# EasyEDA Pro project I2C measurement.eprj

# Schematic Schematic1
Board Name: Board1; Create Date: 2025-07-18; Page Name: P1; Project Name: I2C measurement; Schematic Name: Schematic1; Update Date: 2025-08-10; Company: NUS Calibur; Drawn: Ng Weiliang; Page Size: A4; Reviewed: Ng Weiliang; Version: V1.0
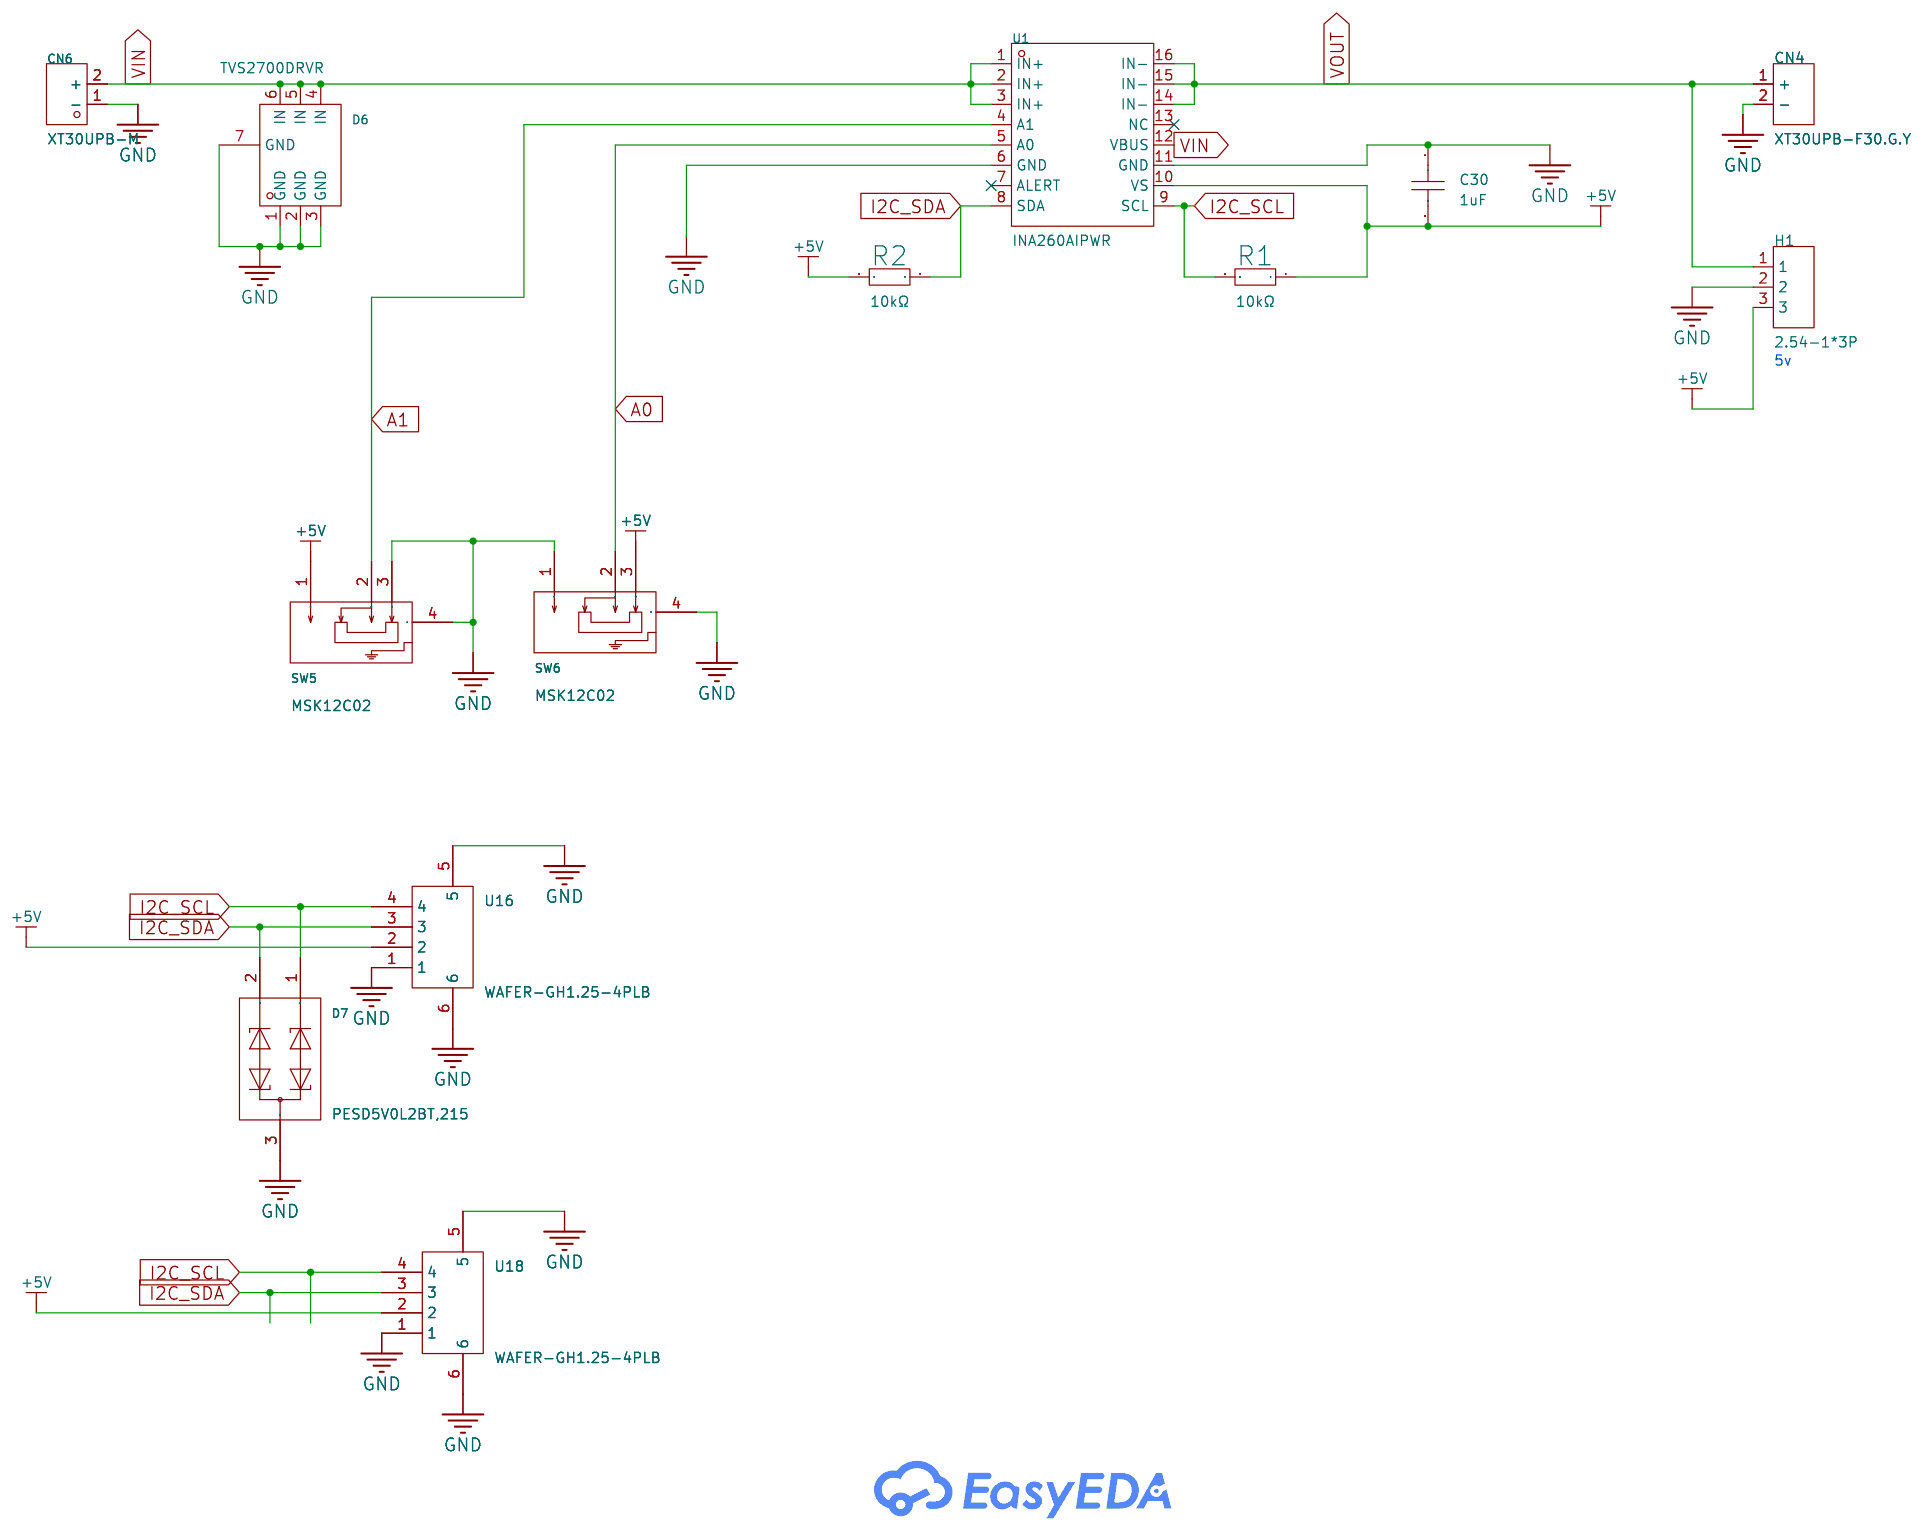
[diagram p0: schematic sheet]

## Parts
C30  1uF  [C0603]
CN4  XT30UPB-F30.G.Y  [CONN-TH_XT30UPB-F]
CN6  XT30UPB-M  [CONN-TH_XT30UPB-M]
D6  TVS2700DRVR  [WSON-6_L2.0-W2.0-P0.65-BL-EP]
D7  PESD5V0L2BT,215  [SOT-23-3_L2.9-W1.3-P1.90-LS2.4-BR]
H1  2.54-1*3P  [HDR-TH_3P-P2.54-V-F]  (no BOM)
R1  10kΩ  [R0603]
R2  10kΩ  [R0603]
SW5  MSK12C02  [SW-TH_MSK12C02]
SW6  MSK12C02  [SW-TH_MSK12C02]
U1  INA260AIPWR  [TSSOP-16_L5.0-W4.4-P0.65-LS6.4-BL-1]
U16  WAFER-GH1.25-4PLB  [CONN-SMD_4P-P1.25_XUNPU_WAFER-GH1.25-4PLB]
U18  WAFER-GH1.25-4PLB  [CONN-SMD_4P-P1.25_XUNPU_WAFER-GH1.25-4PLB]

## Library data of the parts
C30 = CL10A105KB8NNNC: Capacitance: Tolerance:±10% Tolerance:±10% Voltage Rated: Temperature Coefficient:; LCSC Part Name: 1uF ±10% 50V; Supplier Part: C15849; Manufacturer: SAMSUNG(三星); Supplier Footprint: 0603; JLCPCB Part Class: Basic Part; Datasheet: https://atta.szlcsc.com/upload/public/pdf/source/20160218/1457707763339.pdf; Supplier: LCSC; Tolerance: ±10%
CN4 = XT30UPB-F30.G.Y: LCSC Part Name: AMASS(艾迈斯)直立焊板式连接器XT30UPB30-F.G.*; Supplier Part: C108769; Manufacturer: AMASS(艾迈斯); JLCPCB Part Class: Extended Part; Datasheet: https://item.szlcsc.com/datasheet/XT30UPB-F30.G.Y/109989.html; Supplier: LCSC; Type: Aviation model plug; Colour: Yellow; RatedVoltage: DC 500V; InterfaceType: Female; MetalMaterial: Gold plating; InsulationMaterial: PA; RatedCurrent: 15A; contact resistance: 0.65mΩ
CN6 = XT30UPB-M: LCSC Part Name: AMASS(艾迈斯)板载立式 航模锂电池控制器连接器插头 公头XT30UPB-M; Supplier Part: C428721; Manufacturer: AMASS(艾迈斯); JLCPCB Part Class: Extended Part; Datasheet: https://item.szlcsc.com/datasheet/XT30UPB-M/423831.html; Supplier: LCSC; Type: Aviation model plug; Colour: Yellow; RatedVoltage: DC 500V; InterfaceType: Male; MetalMaterial: Gold plating; InsulationMaterial: PA; RatedCurrent: 15A; contact resistance: 0.65mΩ
D6 = TVS2700DRVR: Supplier Part: C523797; Manufacturer: TI(德州仪器); Supplier Footprint: WSON-6-EP(2x2); JLCPCB Part Class: Extended Part; Datasheet: https://www.ti.com/cn/lit/gpn/tvs2700; Supplier: LCSC; Type: ESD
D7 = PESD5V0L2BT,215: Maximum Clamping Voltage:28V Breakdown Voltage:7V Number of Lines:双路 Type:ESD; Supplier Part: C12324; Manufacturer: Nexperia(安世); Supplier Footprint: SOT-23; JLCPCB Part Class: Extended Part; Datasheet: https://atta.szlcsc.com/upload/public/pdf/source/20150713/1457707329955.pdf; Supplier: LCSC; Maximum Clamping Voltage: 28V; Breakdown Voltage: 7V; Number of Lines: 双路; Type: ESD
H1 = 2.54-1*3P母: Pitch:2.54mm Row Spacing:- Mounting Type:Through Hole Number of Rows:1 Number of Positions:3P Insulation Height:- Contact Material:- Contact Plating:Gold; LCSC Part Name: 间距:2.54mm 直插; Supplier Part: C146243; Manufacturer: BOOMELE(博穆精密); Supplier Footprint: 插件,P=2.54mm; JLCPCB Part Class: Extended Part; Supplier: LCSC; Pitch: 2.54mm; Mounting Type: Through Hole; Number of Rows: 1; Number of Positions: 3P; Contact Plating: Gold
R1 R2 = 0603WAF1002T5E: LCSC Part Name: 厚膜电阻 10kΩ ±1% 100mW; Supplier Part: C25804; Manufacturer: UNI-ROYAL(厚声); Supplier Footprint: 0603; JLCPCB Part Class: Basic Part; Datasheet: https://atta.szlcsc.com/upload/public/pdf/source/20200306/C422600_1E6D84923E4A46A82E41ADD87F860B5C.pdf; Supplier: LCSC; Type: Thick Film Resistor; Tolerance: ±1%; Power(Watts): 100mW; Voltage-Supply(Max): 75V; Temperature Coefficient: ±100ppm/℃; Operating Temperature: -55℃~+155℃
SW5 SW6 = MSK12C02: LCSC Part Name: 两档侧拨贴片 7脚 滑动开关; Supplier Part: C431540; Manufacturer: SHOU HAN(首韩); Supplier Footprint: SMD; JLCPCB Part Class: Extended Part; Datasheet: https://atta.szlcsc.com/upload/public/pdf/source/20190925/C431540_89155AEF0758B9AD1B2D805F83FB12E3.pdf; Supplier: LCSC; Circuit: SPDT; Pin Style: SMDSplicing; Switch Length: 8mm; Switch Width: 2.8mm; Switch Height: 1.4mm; Mounting Style: 卧贴; Current Rating (DC): 50mA; Voltage Rating (DC): 12V; Mechanical Life: 1万次; Operating Temperature: -20℃~+70℃
U1 = INA260AIPWR: LCSC Part Name: 具有低漂移、高精度集成分流器的精密电流和功率监测计; Supplier Part: C2155885; Manufacturer: TI(德州仪器); Supplier Footprint: TSSOP-16; JLCPCB Part Class: Extended Part; Datasheet: https://www.ti.com/cn/lit/gpn/ina260; Supplier: LCSC
U16 U18 = WAFER-GH1.25-4PLB: LCSC Part Name: 1x4P 间距:1.25mm 立贴 系列:GH; Supplier Part: C3029370; Manufacturer: XUNPU(讯普); Supplier Footprint: SMD,P=1.25mm; JLCPCB Part Class: Extended Part; Datasheet: https://atta.szlcsc.com/upload/public/pdf/source/20220527/44F824AAC8C2B617205E15955FF9C23D.pdf; Supplier: LCSC; Pins Structure: 1x4P; Pitch: 1.25mm; Mounting Type: Standing paste; Reference Series: GH; Number of Pins: 4P; Number of Rows: 1; Number of PINs Per Row: 4; Current Rating: 1A; Contact Material: Brass; Operating Temperature: -25℃~+85℃; Voltage Rating: 125V; Plastic Material: LCP; Supplementary Features: Auxiliary soldering legs; Color: Beige; Z-Height of the Board: 4.2mm; X-Length of Bottom Edge on Board (Spacing Line): 8.25mm; Y-Width of Bottom Edge on Board: 4.95mm

## Nets
+5V: C30.2 H1.3 R1.1 R2.2 SW5.1 SW6.3 U1.10(VS) U16.2 U18.2
GND: C30.1 CN4.2(-) CN6.1(-) D6.1(GND) D6.2(GND) D6.3(GND) D6.7(GND) D7.3(DC) H1.2 SW5.3 SW5.4 SW6.1 SW6.4 U1.6(GND) U1.11(GND) U16.1 U16.5 U16.6 U18.1 U18.5 U18.6
VIN: CN6.2(+) D6.4(IN) D6.5(IN) D6.6(IN) U1.1(IN+) U1.2(IN+) U1.3(IN+) U1.12(VBUS)
A0: SW6.2 U1.5(A0)
A1: SW5.2 U1.4(A1)
I2C_SCL: D7.1(C1) R1.2 U1.9(SCL) U16.4 U18.4
I2C_SDA: D7.2(C2) R2.1 U1.8(SDA) U16.3 U18.3
VOUT: CN4.1(+) H1.1 U1.14(IN-) U1.15(IN-) U1.16(IN-)

Not connected (* = marked no-connect by the designer): U1 7(ALERT)* 13(NC)*

## Notes on the sheet
- 5v

# Schematic Schematic2
Board Name: Schematic2; Create Date: 2025-08-09; Page Name: P1; Project Name: I2C measurement; Schematic Name: Schematic2; Update Date: 2025-08-10; Company: EasyEDA.com; Page Size: A4; Version: V1.0
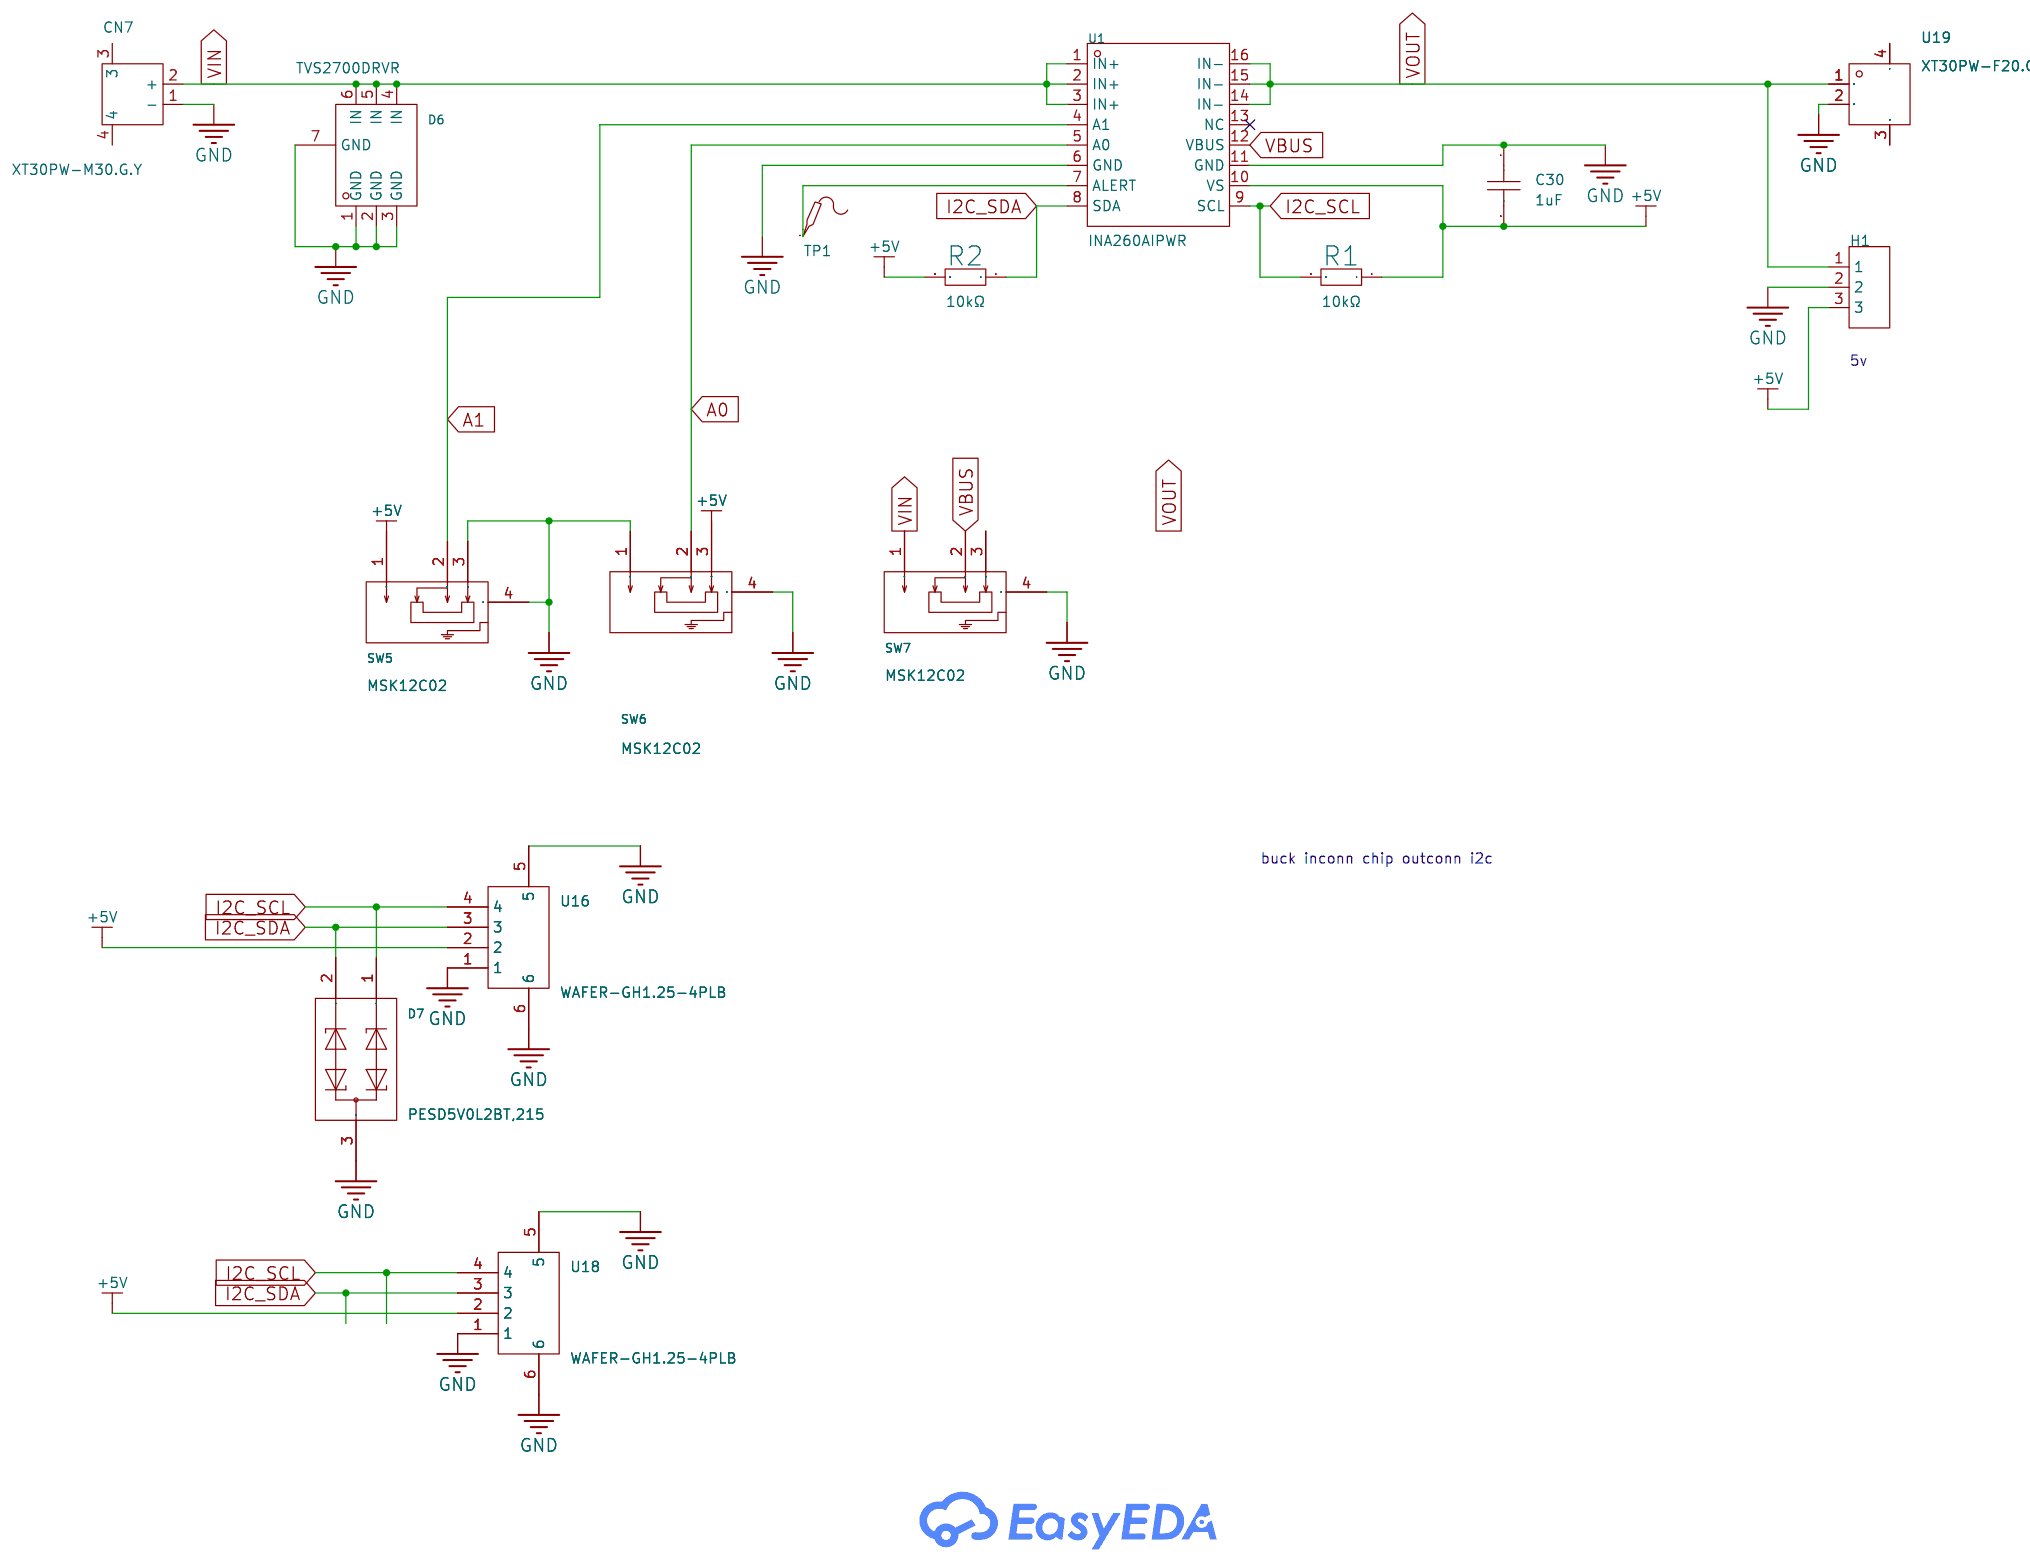
[diagram p1: schematic sheet]

## Parts
C30  1uF  [C0603]
CN7  XT30PW-M30.G.Y  [CONN-TH_XT30PW-M]
D6  TVS2700DRVR  [WSON-6_L2.0-W2.0-P0.65-BL-EP]
D7  PESD5V0L2BT,215  [SOT-23-3_L2.9-W1.3-P1.90-LS2.4-BR]
H1  2.54-1*3P母  [HDR-TH_3P-P2.54-V-F]
R1  10kΩ  [R0603]
R2  10kΩ  [R0603]
SW5  MSK12C02  [SW-TH_MSK12C02]
SW6  MSK12C02  [SW-TH_MSK12C02]
SW7  MSK12C02  [SW-TH_MSK12C02]
TP1  -  [Test-Point-0.5mm]
U1  INA260AIPWR  [TSSOP-16_L5.0-W4.4-P0.65-LS6.4-BL-1]
U16  WAFER-GH1.25-4PLB  [CONN-SMD_4P-P1.25_XUNPU_WAFER-GH1.25-4PLB]
U18  WAFER-GH1.25-4PLB  [CONN-SMD_4P-P1.25_XUNPU_WAFER-GH1.25-4PLB]
U19  XT30PW-F20.G.Y  [CONN-TH_XT30PW-F-1]

## Library data of the parts
C30 = CL10A105KB8NNNC: Capacitance: Tolerance:±10% Tolerance:±10% Voltage Rated: Temperature Coefficient:; LCSC Part Name: 1uF ±10% 50V; Supplier Part: C15849; Manufacturer: SAMSUNG(三星); Supplier Footprint: 0603; JLCPCB Part Class: Basic Part; Datasheet: https://atta.szlcsc.com/upload/public/pdf/source/20160218/1457707763339.pdf; Supplier: LCSC; Tolerance: ±10%
CN7 = XT30PW-M30.G.Y: Power:- Output:- Input:- Size:- Interface:- Type:- Colour:- MaximumCurrent:- Type:Aviation model plug RatedVoltage:DC 500V Type1:- NumberOfUSBHoles:- InterfaceType:Male MetalMaterial:- InsulationMaterial:- RatedCurrent:15A RecommendedWireGauge:16/18/20AWG; LCSC Part Name: AMASS(艾迈斯)航模插头 卧式弯脚 XT30PW-M公头; Supplier Part: C431092; Manufacturer: AMASS(艾迈斯); JLCPCB Part Class: Extended Part; Datasheet: https://atta.szlcsc.com/upload/public/pdf/source/20220222/6A9F22F7850E25B33E1BE430ADF8560B.pdf; Supplier: LCSC; Type: Aviation model plug; RatedVoltage: DC 500V; InterfaceType: Male; RatedCurrent: 15A; RecommendedWireGauge: 16/18/20AWG; contact resistance: 1.2mΩ; specifications: 2pin
D6 = TVS2700DRVR: Supplier Part: C523797; Manufacturer: TI(德州仪器); Supplier Footprint: WSON-6-EP(2x2); JLCPCB Part Class: Extended Part; Datasheet: https://www.ti.com/cn/lit/gpn/tvs2700; Supplier: LCSC; Type: ESD
D7 = PESD5V0L2BT,215: Maximum Clamping Voltage:28V Breakdown Voltage:7V Number of Lines:双路 Type:ESD; Supplier Part: C12324; Manufacturer: Nexperia(安世); Supplier Footprint: SOT-23; JLCPCB Part Class: Extended Part; Datasheet: https://atta.szlcsc.com/upload/public/pdf/source/20150713/1457707329955.pdf; Supplier: LCSC; Maximum Clamping Voltage: 28V; Breakdown Voltage: 7V; Number of Lines: 双路; Type: ESD
H1 = 2.54-1*3P母: Pitch:2.54mm Row Spacing:- Mounting Type:Through Hole Number of Rows:1 Number of Positions:3P Insulation Height:- Contact Material:- Contact Plating:Gold; LCSC Part Name: 间距:2.54mm 直插; Supplier Part: C146243; Manufacturer: BOOMELE(博穆精密); Supplier Footprint: 插件,P=2.54mm; JLCPCB Part Class: Extended Part; Supplier: LCSC; Pitch: 2.54mm; Mounting Type: Through Hole; Number of Rows: 1; Number of Positions: 3P; Contact Plating: Gold
R1 R2 = 0603WAF1002T5E: LCSC Part Name: 厚膜电阻 10kΩ ±1% 100mW; Supplier Part: C25804; Manufacturer: UNI-ROYAL(厚声); Supplier Footprint: 0603; JLCPCB Part Class: Basic Part; Datasheet: https://atta.szlcsc.com/upload/public/pdf/source/20200306/C422600_1E6D84923E4A46A82E41ADD87F860B5C.pdf; Supplier: LCSC; Type: Thick Film Resistor; Tolerance: ±1%; Power(Watts): 100mW; Voltage-Supply(Max): 75V; Temperature Coefficient: ±100ppm/℃; Operating Temperature: -55℃~+155℃
SW5-SW7 = MSK12C02: LCSC Part Name: 两档侧拨贴片 7脚 滑动开关; Supplier Part: C431540; Manufacturer: SHOU HAN(首韩); Supplier Footprint: SMD; JLCPCB Part Class: Extended Part; Datasheet: https://atta.szlcsc.com/upload/public/pdf/source/20190925/C431540_89155AEF0758B9AD1B2D805F83FB12E3.pdf; Supplier: LCSC; Circuit: SPDT; Pin Style: SMDSplicing; Switch Length: 8mm; Switch Width: 2.8mm; Switch Height: 1.4mm; Mounting Style: 卧贴; Current Rating (DC): 50mA; Voltage Rating (DC): 12V; Mechanical Life: 1万次; Operating Temperature: -20℃~+70℃
TP1 = Test-Point
U1 = INA260AIPWR: LCSC Part Name: 具有低漂移、高精度集成分流器的精密电流和功率监测计; Supplier Part: C2155885; Manufacturer: TI(德州仪器); Supplier Footprint: TSSOP-16; JLCPCB Part Class: Extended Part; Datasheet: https://www.ti.com/cn/lit/gpn/ina260; Supplier: LCSC
U16 U18 = WAFER-GH1.25-4PLB: LCSC Part Name: 1x4P 间距:1.25mm 立贴 系列:GH; Supplier Part: C3029370; Manufacturer: XUNPU(讯普); Supplier Footprint: SMD,P=1.25mm; JLCPCB Part Class: Extended Part; Datasheet: https://atta.szlcsc.com/upload/public/pdf/source/20220527/44F824AAC8C2B617205E15955FF9C23D.pdf; Supplier: LCSC; Pins Structure: 1x4P; Pitch: 1.25mm; Mounting Type: Standing paste; Reference Series: GH; Number of Pins: 4P; Number of Rows: 1; Number of PINs Per Row: 4; Current Rating: 1A; Contact Material: Brass; Operating Temperature: -25℃~+85℃; Voltage Rating: 125V; Plastic Material: LCP; Supplementary Features: Auxiliary soldering legs; Color: Beige; Z-Height of the Board: 4.2mm; X-Length of Bottom Edge on Board (Spacing Line): 8.25mm; Y-Width of Bottom Edge on Board: 4.95mm
U19 = XT30PW-F20.G.Y: Power:- Output:- Input:- Size:- Interface:- Type:- Colour:- MaximumCurrent:- Type:航模插头 RatedVoltage:- Type1:- NumberOfUSBHoles:- InterfaceType:母头 MetalMaterial:- InsulationMaterial:- RatedCurrent:- RecommendedWireGauge:- FlameRetardantGrade:- contact resi; LCSC Part Name: AMASS(艾迈斯)电源连接器 母头 XT30PW-F; Supplier Part: C2913282; Manufacturer: AMASS(艾迈斯); JLCPCB Part Class: Extended Part; Datasheet: https://atta.szlcsc.com/upload/public/pdf/source/20231218/06CFCF98887A9A87638B0856A725C8FD.pdf; Supplier: LCSC; Type: 航模插头; InterfaceType: 母头

## Nets
+5V: C30.2 H1.3 R1.1 R2.2 SW5.1 SW6.3 U1.10(VS) U16.2 U18.2
GND: C30.1 CN7.1(-) D6.1(GND) D6.2(GND) D6.3(GND) D6.7(GND) D7.3(DC) H1.2 SW5.3 SW5.4 SW6.1 SW6.4 SW7.4 U1.6(GND) U1.11(GND) U16.1 U16.5 U16.6 U18.1 U18.5 U18.6 U19.2
VBUS: SW7.2 U1.12(VBUS)
VIN: CN7.2(+) D6.4(IN) D6.5(IN) D6.6(IN) SW7.1 U1.1(IN+) U1.2(IN+) U1.3(IN+)
A0: SW6.2 U1.5(A0)
A1: SW5.2 U1.4(A1)
I2C_SCL: D7.1(C1) R1.2 U1.9(SCL) U16.4 U18.4
I2C_SDA: D7.2(C2) R2.1 U1.8(SDA) U16.3 U18.3
VOUT: H1.1 U1.14(IN-) U1.15(IN-) U1.16(IN-) U19.1
$1N1251: TP1.1 U1.7(ALERT)

Not connected (* = marked no-connect by the designer): CN7 3 4; SW7 3; U1 13(NC)*; U19 3 4

## Notes on the sheet
- 5v
- buck inconn chip outconn i2c

# Board PCB1
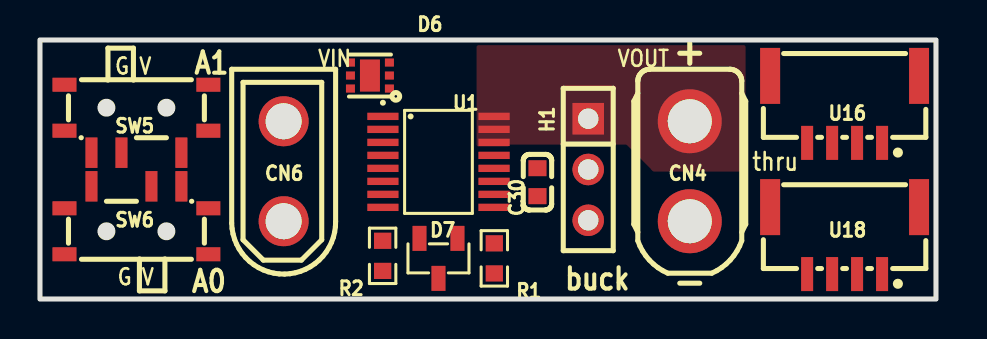
[diagram p2: board, top side]
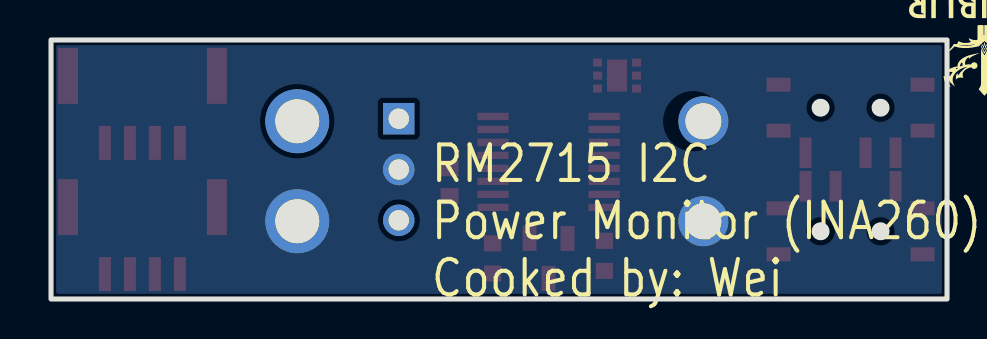
[diagram p3: board, bottom side, seen from below]

Outline 44.83 x 12.95 mm; copper layers: Top Layer, Bottom Layer. Coordinates in mm from the lower left corner of the outline.
Outline path: rectangle 0,12.95 44.83,0
Stack: Top Layer 0.035mm / Dielectric1 1.51mm FR4 er 4.5 / Bottom Layer 0.035mm

## Design rules (mm)
template: Custom Config
spacing copperThickness1oz (default): track to track 0.102, other pairs 0.152 to 0.3
spacing copperThickness2oz: track to track 0.203, other pairs 0.152 to 0.3
track width copperThickness1oz (default): min 0.127, default 0.254, max 2.54
track width copperThickness2oz: min 0.203, default 0.254, max 2.54
differential pair differentialPair (default): width min 0.127, default 0.254, max 2.54; gap min 0.152, default 0.152
via viaSize (default): diameter min 0.5, default 0.61, max 10; hole min 0.3, default 0.305, max 6.3

## Placement (name value [footprint] x y rotation side)
C30  1uF  [C0603]  24.89 5.84 270 top
CN4  XT30UPB-F30.G.Y  [CONN-TH_XT30UPB-F]  32.51 6.39 270 top
CN6  XT30UPB-M  [CONN-TH_XT30UPB-M]  12.19 6.39 90 top
D6  TVS2700DRVR  [WSON-6_L2.0-W2.0-P0.65-BL-EP]  16.51 11.18 90 top
D7  PESD5V0L2BT,215  [SOT-23-3_L2.9-W1.3-P1.90-LS2.4-BR]  19.94 2.03 90 top
H1  2.54-1*3P  [HDR-TH_3P-P2.54-V-F]  27.43 6.48 270 top
R1  10kΩ  [R0603]  22.73 2.03 90 top
R2  10kΩ  [R0603]  17.15 2.16 270 top
SW5  MSK12C02  [SW-TH_MSK12C02]  4.83 9.02 180 top
SW6  MSK12C02  [SW-TH_MSK12C02]  4.83 3.94 0 top
U1  INA260AIPWR  [TSSOP-16_L5.0-W4.4-P0.65-LS6.4-BL-1]  19.94 6.86 270 top
U16  WAFER-GH1.25-4PLB  [CONN-SMD_4P-P1.25_XUNPU_WAFER-GH1.25-4PLB]  40.26 9.48 180 top
U18  WAFER-GH1.25-4PLB  [CONN-SMD_4P-P1.25_XUNPU_WAFER-GH1.25-4PLB]  40.26 2.92 180 top

## Footprints (pads in the part's own frame, mm; a bottom-side part is the same pattern mirrored in y, then rotated)
C0603
  rect 0.8x0.9 smd: 1(-0.7,0) 2(0.7,0)
CONN-SMD_4P-P1.25_XUNPU_WAFER-GH1.25-4PLB
  rect 0.6x1.7 smd: 1(-1.875,1.675) 2(-0.625,1.675) 3(0.625,1.675) 4(1.875,1.675)
  rect 1x2.8 smd: 5(-3.725,-1.675) 6(3.725,-1.675)
CONN-TH_XT30UPB-F
  round 3.2 hole 2.2: 1(-2.5,0) 2(2.5,0)
CONN-TH_XT30UPB-M
  round 2.5 hole 1.8: 1(-2.5,0) 2(2.5,0)
HDR-TH_3P-P2.54-V-F
  rect 1.575x1.575 hole 1.02: 1(-2.54,0)
  round 1.575 hole 1.02: 2(0,0) 3(2.54,0)
R0603
  rect 0.806x0.864 smd: 1(-0.753,0) 2(0.753,0)
SOT-23-3_L2.9-W1.3-P1.90-LS2.4-BR
  rect 1.25x0.7 smd: 1(1,-0.95) 2(1,0.95) 3(-1,0)
SW-TH_MSK12C02
  rect 0.6x1.524 smd: 1(-2.25,1.7) 2(0.75,1.7) 3(2.25,1.7)
  rect 1.2x0.7 smd: 4(-3.6,0.6) 4(-3.6,-1.7) 4(3.6,0.6) 4(3.6,-1.7)
TSSOP-16_L5.0-W4.4-P0.65-LS6.4-BL-1
  rect 0.364x1.56 smd: 1(-2.275,-2.78) 2(-1.625,-2.78) 3(-0.975,-2.78) 4(-0.325,-2.78) 5(0.325,-2.78) 6(0.975,-2.78) 7(1.625,-2.78) 8(2.275,-2.78) 9(2.275,2.78) 10(1.625,2.78) 11(0.975,2.78) 12(0.325,2.78) 13(-0.325,2.78) 14(-0.975,2.78) 15(-1.625,2.78) 16(-2.275,2.78)
WSON-6_L2.0-W2.0-P0.65-BL-EP
  rect 0.4x0.45 smd: 1(-0.65,-0.975) 2(0,-0.975) 3(0.65,-0.975) 4(0.65,0.975) 5(0,0.975) 6(-0.65,0.975)
  rect 1.6x1 smd: 7(0,0)

## Nets
As in the schematic.

Pads without a net: U1 7 13

## Copper pours and planes (outline as drawn; the poured copper is in the pictures)
GND on Bottom Layer: -20.32,13.46 51.56,13.46 51.56,-0.76 -20.32,-0.76
VOUT on Top Layer: 35.31,12.93 21.84,12.93 21.84,7.6 23.5,7.6 23.5,7.72 29.34,7.72 30.69,6.37 35.31,6.37

## Text on the board
Bottom Silkscreen Layer: RM2715 I2C / Power Monitor (INA260) / Cooked by: Wei
Top Silkscreen Layer: G V | VIN | VOUT | thru | MAX: / 27V / 15A | A0 | A1 | buck

# Board PCB2
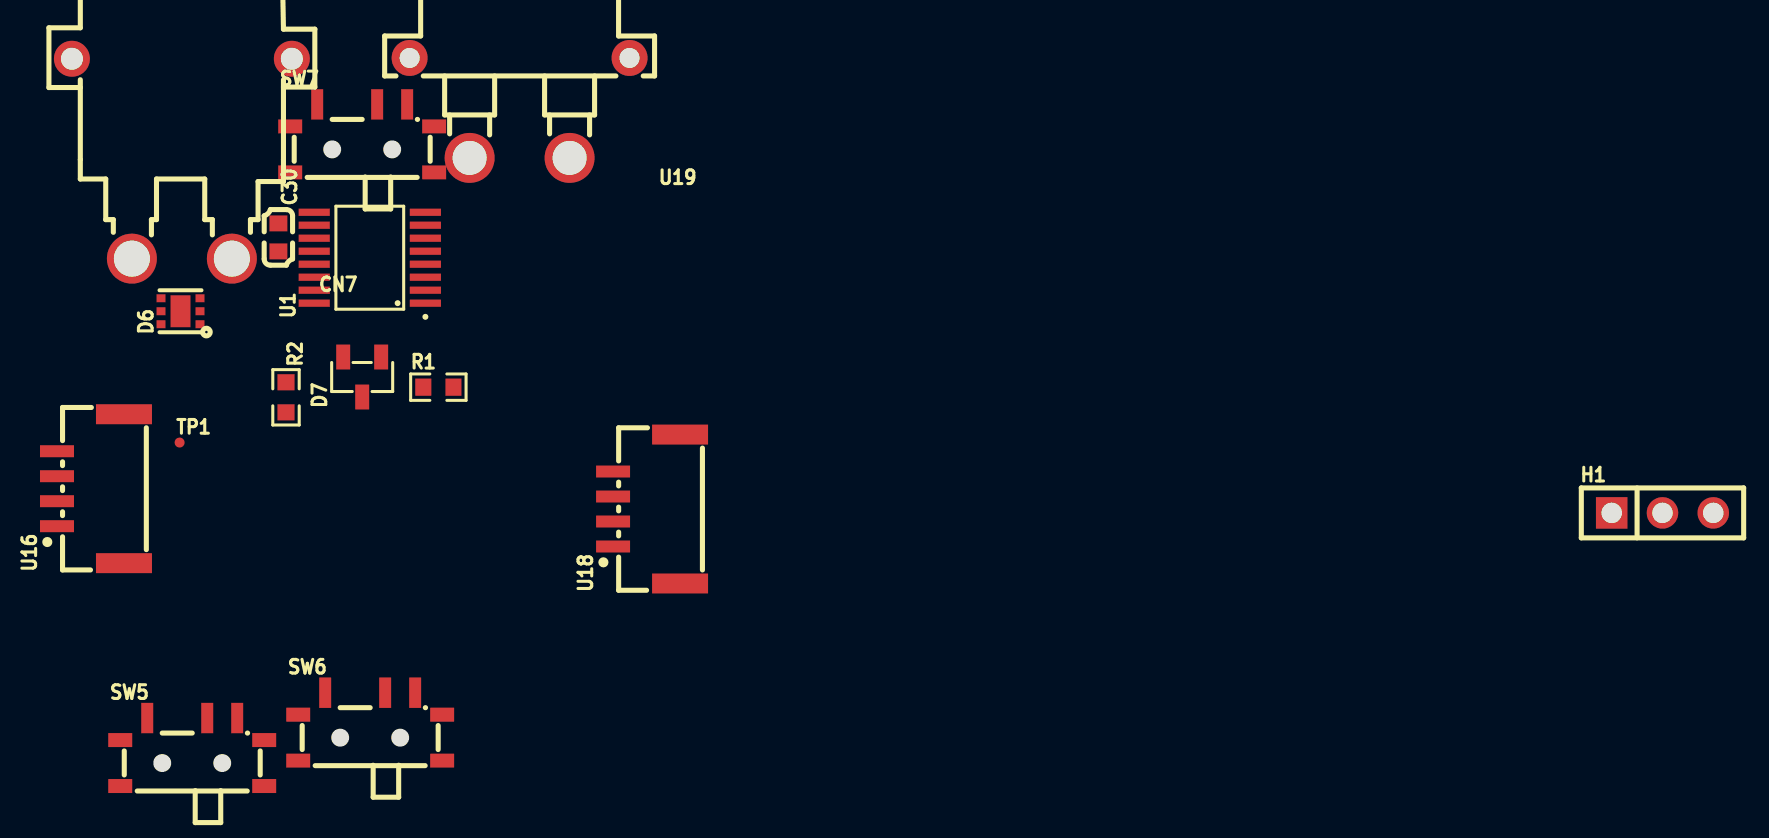
[diagram p4: board, top side]
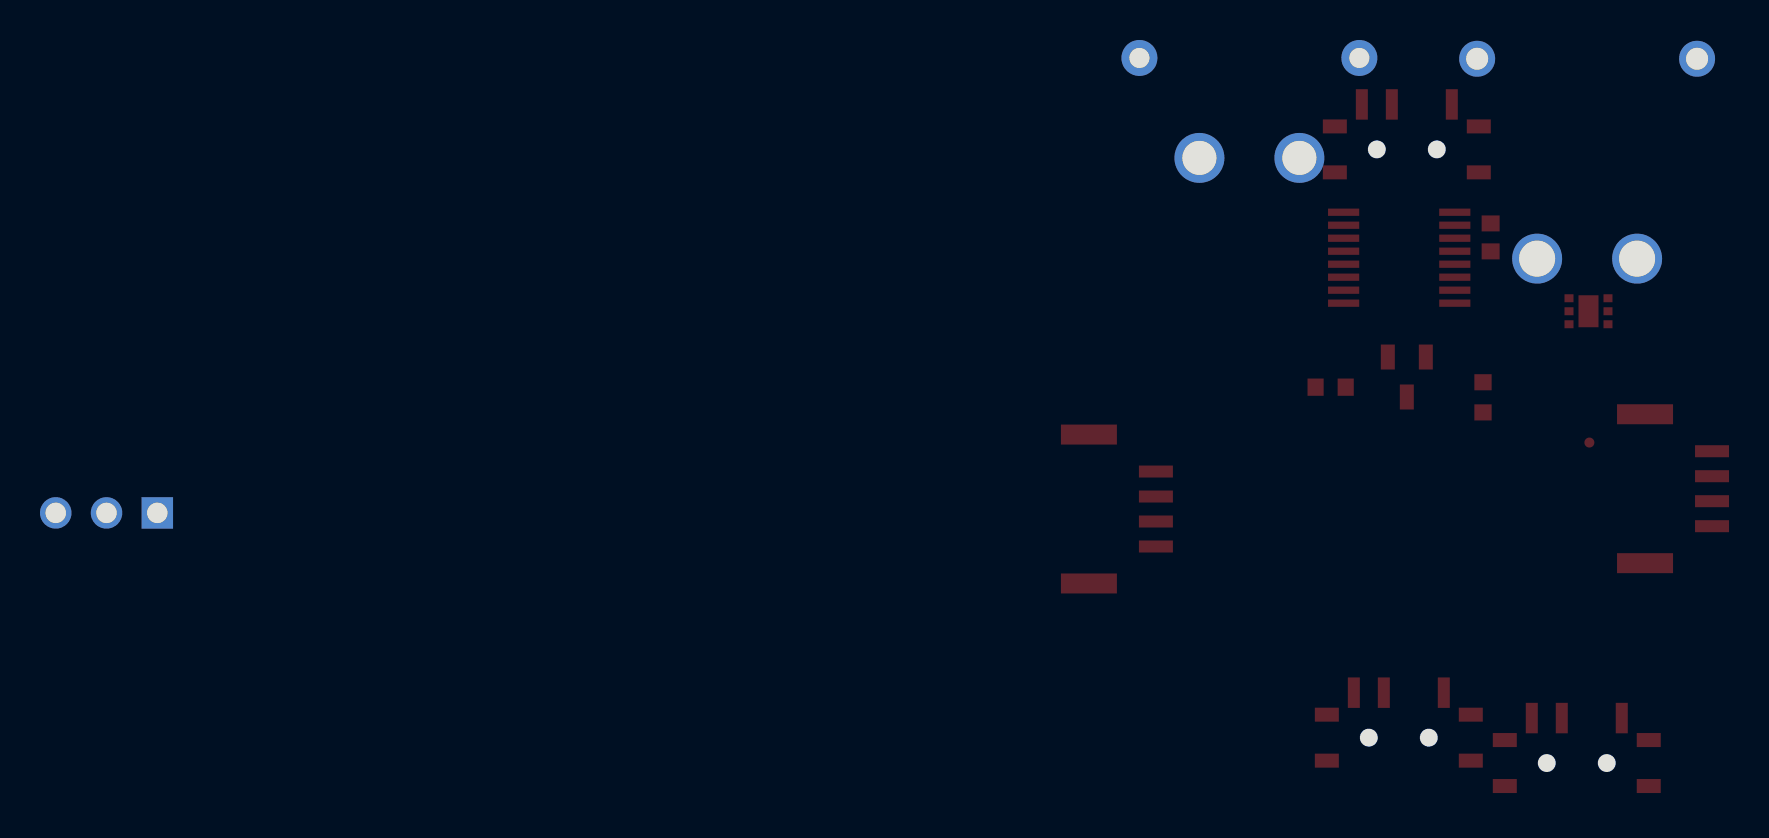
[diagram p5: board, bottom side, seen from below]

Outline 12.79 x 31.59 mm; copper layers: Top Layer, Bottom Layer. Coordinates in mm from the lower left corner of the outline.
Stack: Top Layer 0.035mm / Dielectric1 1.51mm FR4 er 4.5 / Bottom Layer 0.035mm

## Design rules (mm)
template: JLCPCB Capability(Two Layers Board)
spacing copperThickness1oz (default): track to track 0.102, other pairs 0.152 to 0.3
spacing copperThickness2oz: track to track 0.203, other pairs 0.152 to 0.3
track width copperThickness1oz (default): min 0.127, default 0.254, max 2.54
track width copperThickness2oz: min 0.203, default 0.254, max 2.54
differential pair differentialPair (default): width min 0.127, default 0.254, max 2.54; gap min 0.152, default 0.152
via viaSize (default): diameter min 0.5, default 0.61, max 10; hole min 0.3, default 0.305, max 6.3

## Placement (name value [footprint] x y rotation side)
C30  1uF  [C0603]  6.26 26.74 270 top
CN7  XT30PW-M30.G.Y  [CONN-TH_XT30PW-M]  1.43 30.68 180 top
D6  TVS2700DRVR  [WSON-6_L2.0-W2.0-P0.65-BL-EP]  1.36 23.05 90 top
D7  PESD5V0L2BT,215  [SOT-23-3_L2.9-W1.3-P1.90-LS2.4-BR]  10.45 19.76 90 top
H1  2.54-1*3P母  [HDR-TH_3P-P2.54-V-F]  75.48 12.96 0 top
R1  10kΩ  [R0603]  14.26 19.25 0 top
R2  10kΩ  [R0603]  6.64 18.74 270 top
SW5  MSK12C02  [SW-TH_MSK12C02]  1.95 1 0 top
SW6  MSK12C02  [SW-TH_MSK12C02]  10.85 2.27 0 top
SW7  MSK12C02  [SW-TH_MSK12C02]  10.45 31.7 0 top
TP1  -  [Test-Point-0.5mm]  1.32 16.48 0 top
U1  INA260AIPWR  [TSSOP-16_L5.0-W4.4-P0.65-LS6.4-BL-1]  10.83 25.73 90 top
U16  WAFER-GH1.25-4PLB  [CONN-SMD_4P-P1.25_XUNPU_WAFER-GH1.25-4PLB]  -3.14 14.17 90 top
U18  WAFER-GH1.25-4PLB  [CONN-SMD_4P-P1.25_XUNPU_WAFER-GH1.25-4PLB]  24.67 13.16 90 top
U19  XT30PW-F20.G.Y  [CONN-TH_XT30PW-F-1]  18.32 33.22 180 top

## Footprints (pads in the part's own frame, mm; a bottom-side part is the same pattern mirrored in y, then rotated)
C0603
  rect 0.8x0.9 smd: 1(-0.7,0) 2(0.7,0)
CONN-SMD_4P-P1.25_XUNPU_WAFER-GH1.25-4PLB
  rect 0.6x1.7 smd: 1(-1.875,1.675) 2(-0.625,1.675) 3(0.625,1.675) 4(1.875,1.675)
  rect 1x2.8 smd: 5(-3.725,-1.675) 6(3.725,-1.675)
CONN-TH_XT30PW-F-1
  round 2.5 hole 1.7: 1(-2.5,2.5) 2(2.5,2.5)
  round 1.8 hole 1: 3(5.5,-2.5) 4(-5.5,-2.5)
CONN-TH_XT30PW-M
  round 2.5 hole 1.8: 1(-2.5,5) 2(2.5,5)
  round 1.8 hole 1.1: 3(5.5,-5) 4(-5.5,-5)
HDR-TH_3P-P2.54-V-F
  rect 1.575x1.575 hole 1.02: 1(-2.54,0)
  round 1.575 hole 1.02: 2(0,0) 3(2.54,0)
R0603
  rect 0.806x0.864 smd: 1(-0.753,0) 2(0.753,0)
SOT-23-3_L2.9-W1.3-P1.90-LS2.4-BR
  rect 1.25x0.7 smd: 1(1,-0.95) 2(1,0.95) 3(-1,0)
SW-TH_MSK12C02
  rect 0.6x1.524 smd: 1(-2.25,1.7) 2(0.75,1.7) 3(2.25,1.7)
  rect 1.2x0.7 smd: 4(-3.6,0.6) 4(-3.6,-1.7) 4(3.6,0.6) 4(3.6,-1.7)
Test-Point-0.5mm
  round 0.5 smd: 1(0,0)
TSSOP-16_L5.0-W4.4-P0.65-LS6.4-BL-1
  rect 0.364x1.56 smd: 1(-2.275,-2.78) 2(-1.625,-2.78) 3(-0.975,-2.78) 4(-0.325,-2.78) 5(0.325,-2.78) 6(0.975,-2.78) 7(1.625,-2.78) 8(2.275,-2.78) 9(2.275,2.78) 10(1.625,2.78) 11(0.975,2.78) 12(0.325,2.78) 13(-0.325,2.78) 14(-0.975,2.78) 15(-1.625,2.78) 16(-2.275,2.78)
WSON-6_L2.0-W2.0-P0.65-BL-EP
  rect 0.4x0.45 smd: 1(-0.65,-0.975) 2(0,-0.975) 3(0.65,-0.975) 4(0.65,0.975) 5(0,0.975) 6(-0.65,0.975)
  rect 1.6x1 smd: 7(0,0)

## Nets
As in the schematic, except:
+5V: C30.2 H1.3 R1.1 R2.2 SW5.1 SW6.1 U1.10 U16.2 U18.2
GND: C30.1 CN7.1 D6.1 D6.2 D6.3 D6.7 D7.3 H1.2 SW5.3 SW5.4 SW6.3 SW6.4 SW7.4 U1.6 U1.11 U16.1 U16.5 U16.6 U18.1 U18.5 U18.6 U19.2

Pads without a net: CN7 3 4; SW7 3; U1 13; U19 3 4
